# Altium project NetTroll.PrjPcb
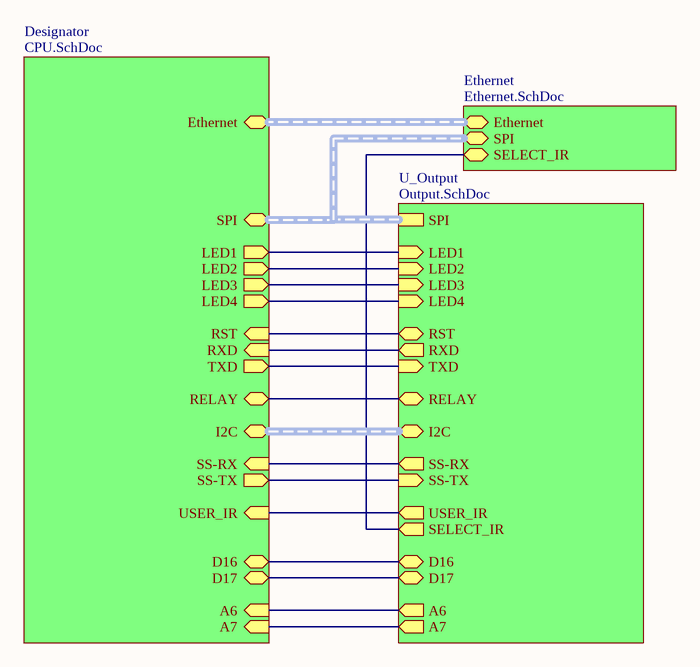
[diagram p0: top.SchDoc]
4 sheets, 90 parts. Net scope: hierarchical (ports join the sheet entries above them; power ports are global).
Board file: NetTroll.PcbDoc
Sheets:
  top.SchDoc
    Designator = CPU.SchDoc
    Ethernet = Ethernet.SchDoc
    U_Output = Output.SchDoc

## Sheet top.SchDoc: WZ1262 - WIZnet Connect the Magic 2014 Design Challenge
size A4; Revision: 1.0

### Sub-sheets
Designator = CPU.SchDoc: A6 (in), A7 (in), D16, Ethernet (harness Ethernet), I2C (harness I2C), LED1 (out), LED2 (out), LED3 (out), LED4 (out), RELAY, RST (in), RXD (in), SPI (harness SPI), SS-RX (in), SS-TX (out), TXD (out), USER_IR (in), D17
Ethernet = Ethernet.SchDoc: SPI (harness SPI), Ethernet (harness Ethernet), SELECT_IR
U_Output = Output.SchDoc: LED1, LED2, LED3, SPI (harness SPI), RST, RXD, TXD, LED4, RELAY, I2C (harness I2C), SS-RX (out), SS-TX (in), USER_IR (out), D16, D17, A6 (out), A7 (out), SELECT_IR (out)

### Nets
A0/D14: sheet Designator/SS-TX, sheet U_Output/SS-TX
A1/D15: sheet Designator/SS-RX, sheet U_Output/SS-RX
A2/D16: sheet Designator/D16, sheet U_Output/D16
A6: sheet Designator/A6, sheet U_Output/A6
A7: sheet Designator/A7, sheet U_Output/A7
D5-PWM: sheet Designator/LED1, sheet U_Output/LED1
D6-PWM: sheet Designator/LED2, sheet U_Output/LED2
D8: sheet Designator/RELAY, sheet U_Output/RELAY
D9-PWM: sheet Designator/LED3, sheet U_Output/LED3
D10-PWM: sheet Designator/LED4, sheet U_Output/LED4
D17: sheet Designator/D17, sheet U_Output/D17
EXT_INT_SEL: sheet Ethernet/SELECT_IR, sheet U_Output/SELECT_IR
INT1/D3: sheet Designator/USER_IR, sheet U_Output/USER_IR
RST: sheet Designator/RST, sheet U_Output/RST
XD1_N: sheet Designator/RXD, sheet U_Output/RXD
XD1_P: sheet Designator/TXD, sheet U_Output/TXD

### Buses and harness runs
harness sheet Designator/Ethernet = sheet Ethernet/Ethernet
harness sheet Designator/I2C = sheet U_Output/I2C
harness sheet Designator/SPI = sheet Ethernet/SPI = sheet U_Output/SPI

## Sheet CPU.SchDoc: WZ1262 - WIZnet Connect the Magic 2014 Design Challenge
size A4; DocumentNumber: 1; Revision: 1.0; SheetNumber: 1; SheetTotal: 4; PageSetup: Record=PageOptions|CenterHorizontal=True|CenterVertical=True|PrintScale=0.31|XCorrection=1.00|YCorrection=1.00|PrintKind=1|BorderSize=5000000|LeftOffset=0|BottomOffset=0|Orientation=2|PaperLength=1000|PaperWidth=1000|Scale=100|PaperSource=7|PrintQuality=600|MediaType=1|DitherType=10|PrintScaleMode=1|PaperKind=A4 (210 x 297mm)|PaperIndex=9
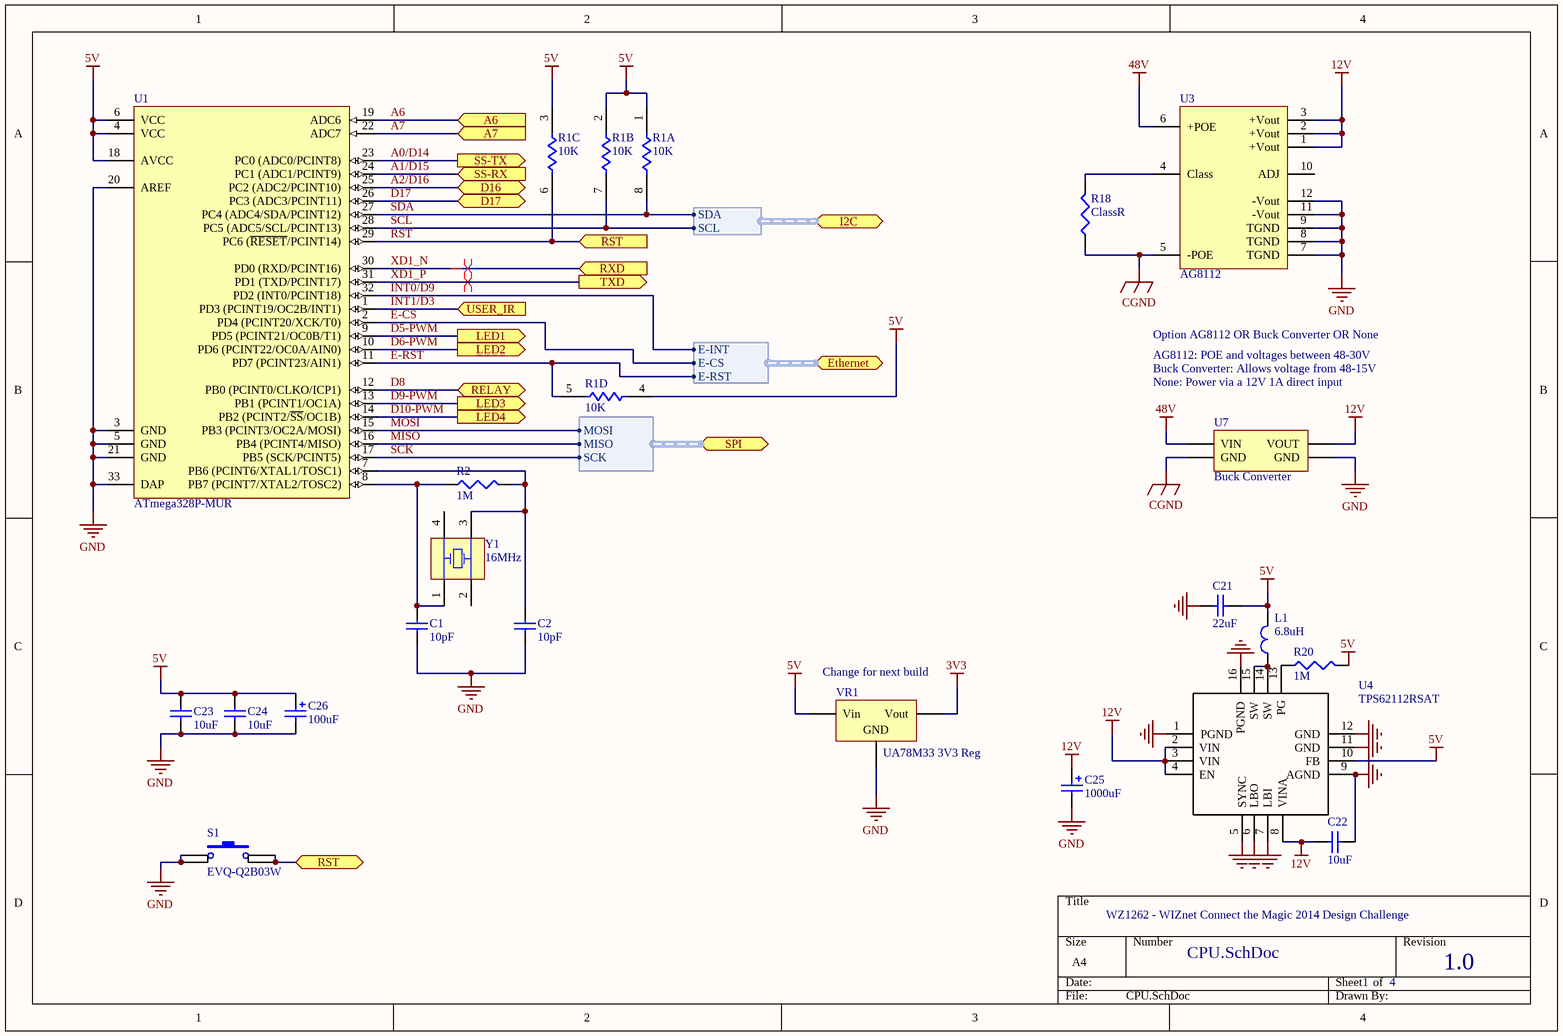
[diagram p1: CPU.SchDoc]

### Parts
C1  10pF  [0603]
C2  10pF  [0603]
C21  22uF  [1210]
C22  10uF  [0603]
C23  10uF  [0603]
C24  10uF  [0603]
C25  1000uF  [PANASONIC_H13]
C26  100uF  [PANASONIC_C]
L1  6.8uH  [1812]
R1  10K  [SO8_S]  (parts A,B,C,D of 4)
R2  1M  [0603]
R18  ClassR  [0603]  (no BOM)
R20  1M  [0603]
S1  EVQ-Q2B03W  [TACTILE_SWITCH_SMD]
U1  ATmega328P-MUR  [32M1-A_N]
U3  AG8112  [AG8100]
U4  TPS62112RSAT  [16-QFN]
U7  Buck Converter  [Buck_Module]
VR1  UA78M33 3V3 Reg  [SOT223]
Y1  16MHz  [CRYSTAL-SMD-2.5X2-ABM10]

### Ports
A6 (in), A7 (in), D16, D17, Ethernet (harness Ethernet), I2C (harness I2C), LED1 (out), LED2 (out), LED3 (out), LED4 (out), RELAY, RST, RST (in), RXD (in), SPI (harness SPI), SS-RX (in), SS-TX (out), TXD (out), USER_IR (in)

### Harnesses
SPI: SCK, MISO, MOSI
Ethernet: E-CS, E-INT, E-RST
I2C: SDA, SCL

### Nets
3V3: VR1.3(Vout)
5V: C21.2 C23.2 C24.2 C26.+ L1.2 R1.1 R1.2 R1.3 R1.4 R20.2 U1.4(VCC) U1.6(VCC) U1.18(AVCC) U4.10(FB) VR1.1(Vin)
12V: C22.1 C25.+ U3.1(+Vout) U3.2(+Vout) U3.3(+Vout) U4.2(VIN) U4.3(VIN) U4.4(EN) U4.8(VINA) U7.2(VOUT)
48V: U3.6(+POE) U7.1(VIN)
CGND: R18.1 U3.5(-POE) U7.4(GND)
GND: C1.1 C2.1 C21.1 C22.2 C23.1 C24.1 C25.- C26.- S1.1 S1.2 U1.3(GND) U1.5(GND) U1.20(AREF) U1.21(GND) U1.33(DAP) U3.7(TGND) U3.8(TGND) U3.9(TGND) U3.11(-Vout) U3.12(-Vout) U4.0(GND) U4.1(PGND) U4.5(SYNC) U4.6(LBO) U4.7(LBI) U4.9(AGND) U4.11(GND) U4.12(GND) U4.16(PGND) U7.3(GND) VR1.2(GND)
A0/D14: U1.23(PC0_(ADC0/PCINT8)) ; port SS-TX
A1/D15: U1.24(PC1_(ADC1/PCINT9)) ; port SS-RX
A2/D16: U1.25(PC2_(ADC2/PCINT10)) ; port D16
A6: U1.19(ADC6) ; port A6
A7: U1.22(ADC7) ; port A7
D5-PWM: U1.9(PD5_(PCINT21/OC0B/T1)) ; port LED1
D6-PWM: U1.10(PD6_(PCINT22/OC0A/AIN0)) ; port LED2
D8: U1.12(PB0_(PCINT0/CLKO/ICP1)) ; port RELAY
D9-PWM: U1.13(PB1_(PCINT1/OC1A)) ; port LED3
D10-PWM: U1.14(PB2_(PCINT2/~{SS}/OC1B)) ; port LED4
D17: U1.26(PC3_(ADC3/PCINT11)) ; port D17
E-CS: U1.2(PD4_(PCINT20/XCK/T0)) ; port Ethernet.E-CS
E-RST: R1.5 U1.11(PD7_(PCINT23/AIN1)) ; port Ethernet.E-RST
INT0/D9: U1.32(PD2_(INT0/PCINT18)) ; port Ethernet.E-INT  [project net E-INT]
INT1/D3: U1.1(PD3_(PCINT19/OC2B/INT1)) ; port USER_IR
MISO: U1.16(PB4_(PCINT4/MISO)) ; port SPI.MISO
MOSI: U1.15(PB3_(PCINT3/OC2A/MOSI)) ; port SPI.MOSI
RST: R1.6 S1.3 S1.4 U1.29(PC6_(~{RESET}/PCINT14)) ; port RST
SCK: U1.17(PB5_(SCK/PCINT5)) ; port SPI.SCK
SCL: R1.7 U1.28(PC5_(ADC5/SCL/PCINT13)) ; port I2C.SCL
SDA: R1.8 U1.27(PC4_(ADC4/SDA/PCINT12)) ; port I2C.SDA
XD1_N: U1.30(PD0_(RXD/PCINT16)) ; port RXD
XD1_P: U1.31(PD1_(TXD/PCINT17)) ; port TXD
NetC1_2: C1.2 R2.1 U1.8(PB7_(PCINT7/XTAL2/TOSC2)) Y1.1(OSC1)
NetC2_2: C2.2 R2.2 U1.7(PB6_(PCINT6/XTAL1/TOSC1)) Y1.3(OSC2)
NetL1_1: L1.1 U4.14(SW) U4.15(SW)
NetR18_2: R18.2 U3.4(Class)
NetR20_1: R20.1 U4.13(PG)

Not connected (* = marked no-connect by the designer): U3 10(ADJ); Y1 2(OSC2) 4(OSC1)

### Layout directives
differential pair: XD1_N, XD1_P

### Notes on the sheet
- Option AG8112 OR Buck Converter OR None
- AG8112: POE and voltages between 48-30V
- Buck Converter: Allows voltage from 48-15V
- None: Power via a 12V 1A direct input
- (near VR1) Change for next build

### Library data of the parts
C1 C2 = Cap_10pF: Capacitor (Semiconductor SIM Model); Published: 8-Jun-2000; LatestRevisionDate: 29-May-2009; LatestRevisionNote: IPC-7351 Footprint Added.; PackageReference: C1206; Publisher: Altium Limited; PackageDescription: Chip Capacitor; Value: 10pF; Supplier 1: Digi-Key; Supplier 2: Mouser; Supplier Part Number 1: 1276-2157-1-ND; Supplier Part Number 2: 80-C0603C100K3G
C21 = Cap_22uF: Capacitor (Semiconductor SIM Model); Published: 8-Jun-2000; LatestRevisionDate: 29-May-2009; LatestRevisionNote: IPC-7351 Footprint Added.; PackageReference: C1206; Publisher: Altium Limited; PackageDescription: Chip Capacitor; Value: 22uF; Supplier 1: Digi-Key; Supplier 2: Mouser; Supplier Part Number 1: 587-1395-1-ND; Supplier Part Number 2: 963-LMK325F226ZN-T
C22-C24 = Cap_10uF: Capacitor (Semiconductor SIM Model); Value: 10uF - 25V; Published: 8-Jun-2000; LatestRevisionDate: 29-May-2009; LatestRevisionNote: IPC-7351 Footprint Added.; PackageReference: C1206; Publisher: Altium Limited; PackageDescription: Chip Capacitor; Supplier 1: Digi-Key; Supplier 2: Mouser; Supplier Part Number 1: 445-9015-1-ND; Supplier Part Number 2: 810-C1608X5R1E106M
C25 = Cap_Polarized_1000uF: Polarized Capacitor (Surface Mount); Published: 8-Jun-2000; LatestRevisionDate: 29-May-2009; LatestRevisionNote: IPC-7351 Footprint Added.; PackageReference: C0805; Publisher: Altium Limited; PackageDescription: Chip Capacitor; Value: 1000uF; Supplier 1: Digi-Key; Supplier 2: Mouser; Supplier Part Number 1: PCE3462CT-ND; Supplier Part Number 2: 140-VE102M1ETR1313
C26 = Cap_Polarized_100uF: Polarized Capacitor (Surface Mount); Published: 8-Jun-2000; LatestRevisionDate: 29-May-2009; LatestRevisionNote: IPC-7351 Footprint Added.; PackageReference: C0805; Publisher: Altium Limited; PackageDescription: Chip Capacitor; Value: 100uF; Supplier 1: Digi-Key; Supplier 2: Mouser; Supplier Part Number 1: PCE4718CT-ND; Supplier Part Number 2: 667-EEE-HAJ101WAR
L1 = INDUCTOR: INDUCTOR WW 6.8UH 1.1A 1812 SMD; MPN: LQH43CN6R8M03L; SPN: 732-4064-6-ND; Cost10: 1.68800; Cost100: 1.28250; Supplier: Digikey; Supplier 1: Digi-Key; Supplier 2: Mouser; Supplier Part Number 1: 490-2518-1-ND; Supplier Part Number 2: 81-LQH43CN6R8M03L
R1 = Resistor_Pack_10K: Isolated Resistor Network - Parts; Sim Note: Enter the Resistance value into parameter field.; Published: 24-Mar-1999; LatestRevisionDate: 29-May-2009; LatestRevisionNote: IPC-7351 Footprint Added.; PackageReference: SOIC16; Publisher: Altium Limited; PackageDescription: 16-Pin Small Outline Integrated Circuit 1.27 mm Pitch; Code_JEDEC: MS-012-AC; Code_IPC: SOIC127P600-16; Value: 10K; Supplier 1: Digi-Key; Supplier 2: Mouser; Supplier Part Number 1: 742C083103JPCT-ND; Supplier Part Number 2: 774-742C083103JP
R2 R20 = Resistor_1M: Resistor; Published: 8-Jun-2000; LatestRevisionDate: 29-May-2009; LatestRevisionNote: IPC-7351 Footprint Added.; PackageReference: J1-0603; Publisher: Altium Limited; PackageDescription: Chip Resistor; Value: 1M; Supplier 1: Digi-Key; Supplier 2: Mouser; Supplier Part Number 1: 311-1MLMCT-ND; Supplier Part Number 2: 603-AF0603FR-071ML
R18 = Resistor: Value: ??; Published: 8-Jun-2000; LatestRevisionDate: 29-May-2009; LatestRevisionNote: IPC-7351 Footprint Added.; PackageReference: J1-0603; Publisher: Altium Limited; PackageDescription: Chip Resistor; Supplier 1: Digi-Key; Supplier 2: Mouser
S1 = SW-PB: Switch; Published: 24-Mar-1999; LatestRevisionDate: 17-Jul-2002; LatestRevisionNote: Re-released for DXP Platform.; PackageReference: SPST-2; Publisher: Altium Limited; PackageDescription: Switch; 2 Leads; Supplier 1: Digi-Key; Supplier 2: Mouser; Supplier Part Number 1: P12932SCT-ND; Supplier Part Number 2: 667-EVQ-Q2B03W
U1 = ATmega328P-MUR: 8-bit AVR Microcontroller, 32KB Flash, 1KB EEPROM, 2KB SRAM, 32-pin MLF, Industrial Grade (-40°C to 85°C); Published: 1-Apr-2010; DatasheetVersion: revA, Jan-2010; PackageVersion: revE, May-2006; PackageReference: 32M1-A; Publisher: Altium Limited; PackageDescription: 32-Pin Micro Lead Frame Package (MLF),  5 x 5 x 1.0 mm Body, Pitch 0.50 mm, 3.10mm Exposed Pad; Supplier 1: Digi-Key; Supplier Part Number 1: ATMEGA328P-MURCT-ND; Supplier 2: Mouser; Supplier Part Number 2: 556-ATMEGA328P-MU; Code_JEDEC: MO-220-VHHD-2; ComponentLink1Description: Manufacturer Link; ComponentLink1URL: http://www.atmel.com/products/avr/default.asp?; ComponentLink2Description: ATmega48A/48PA/88A/88PA/168A/168PA/328/328P Datasheet; ComponentLink2URL: http://www.atmel.com/dyn/resources/prod_documents/8271.pdf; ComponentLink3Description: ATmega48A/48PA/88A/88PA/168A/168PA/328/328P Summary; ComponentLink3URL: http://www.atmel.com/dyn/resources/prod_documents/8271S.pdf; ComponentLink4Description: Atmel.com Home; ComponentLink4URL: http://www.atmel.com
U3 = AG8100: POE Controller and Buck Converter
U4 = TPS62112RSAT: IC REG BUCK SYNC 5V 1.5A 16QFN; SPN: 296-19717-6-ND; Cost10: 3.83100; Cost100: 2.00480; MPN: TPS62112RSAT; Supplier: Digikey; Supplier 1: Digi-Key; Supplier 2: Mouser; Supplier Part Number 1: 296-19717-1-ND; Supplier Part Number 2: 595-TPS62112RSAT
U7 = Buck: Adjustable Buck Converter Module; LatestRevisionDate: 17-Jul-2002; LatestRevisionNote: Re-released for DXP Platform.; Publisher: Altium Limited
VR1 = Volt Reg: Voltage Regulator; Published: 24-Mar-1999; LatestRevisionDate: 29-May-2009; LatestRevisionNote: IPC-7351 Footprint Added.; PackageReference: D2PAK; Publisher: Altium Limited; PackageDescription: 3-Pin Transistor Outline Package 2.54 mm Pitch, 15.1 mm Lead Span; Part: UA78M33; Supplier 1: Digi-Key; Supplier 2: Mouser; Supplier Part Number 1: 296-27140-5-ND; Supplier Part Number 2: 595-UA78M33CDCY
Y1 = Crystal_16MHz: Surface Mount Quartz Crystal; Note: PCB layout complies with manufacturer's recommendation.; Published: 17-Jul-2002; DatasheetDocument: 28-Aug-2001; PackageDocument: 28-Aug-2001; PackageReference: 91SMX; Publisher: Altium Limited; ComponentLink1Description: Manufacturer Link; ComponentLink1URL: http://www.cmac.com/mt/; ComponentLink2Description: Datasheet; ComponentLink2URL: http://www.cmac.com/mt/databook/crystals/smd/90_91_smx.pdf; Value: 16MHz; Supplier 1: Digi-Key; Supplier 2: Mouser; Supplier Part Number 1: 1253-1122-1-ND; Supplier Part Number 2: 732-FA20H-16F12Z-AC3

## Sheet Ethernet.SchDoc: WZ1262 - WIZnet Connect the Magic 2014 Design Challenge
size A4; DocumentNumber: 2; Revision: 1.0; SheetNumber: 2; SheetTotal: 4
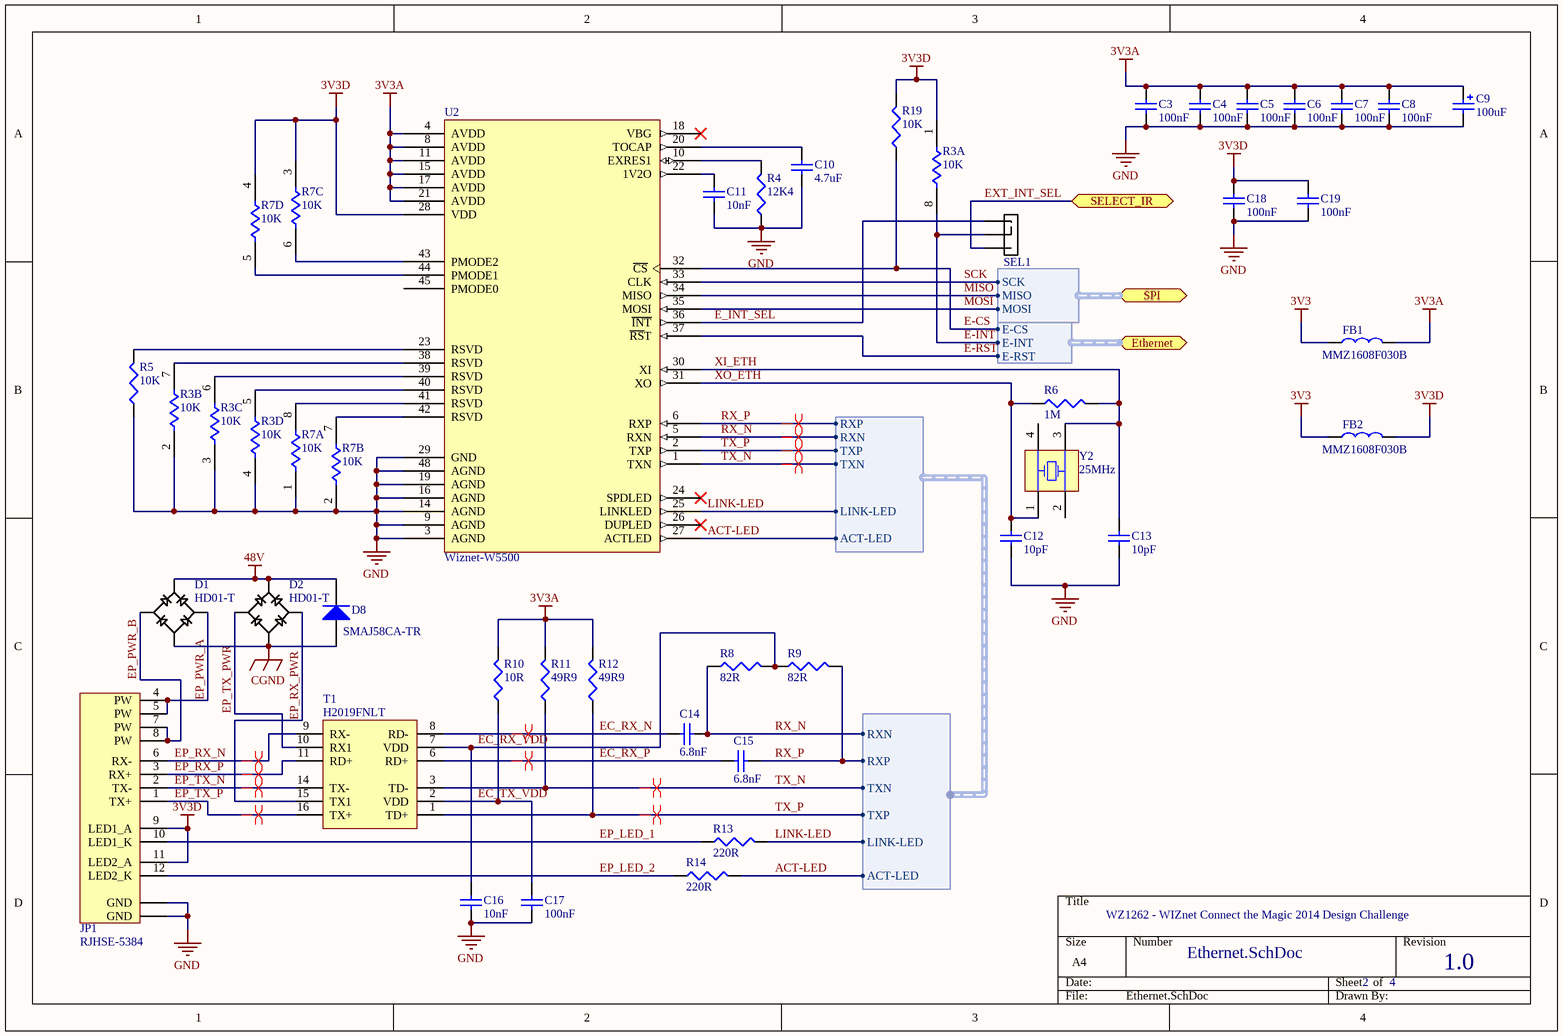
[diagram p2: Ethernet.SchDoc]

### Parts
C3  100nF  [0603]
C4  100nF  [0603]
C5  100nF  [0603]
C6  100nF  [0603]
C7  100nF  [0603]
C8  100nF  [0603]
C9  100uF  [PANASONIC_C]
C10  4.7uF  [0603]
C11  10nF  [0603]
C12  10pF  [0603]
C13  10pF  [0603]
C14  6.8nF  [0603]
C15  6.8nF  [0603]
C16  10nF  [0603]
C17  100nF  [0603]
C18  100nF  [0603]
C19  100nF  [0603]
D1  HD01-T  [MBS]
D2  HD01-T  [MBS]
D8  SMAJ58CA-TR  [SMBJ]
FB1  MMZ1608F030B  [0603]
FB2  MMZ1608F030B  [0603]
JP1  RJHSE-5384  [RJHSE-5484]
R3  10K  [SO8_S]  (parts A,B,C,D of 4)
R4  12K4  [0603]
R5  10K  [0603]
R6  1M  [0603]
R7  10K  [SO8_S]  (parts A,B,C,D of 4)
R8  82R  [0603]
R9  82R  [0603]
R10  10R  [0603]
R11  49R9  [0603]
R12  49R9  [0603]
R13  220R  [0603]
R14  220R  [0603]
R19  10K  [0603]
SEL1  SELECTOR  [SJ_3_PASTE2&3]  (value not drawn)  (no BOM)
T1  H2019FNLT  [HXXXX]
U2  Wiznet-W5500  [QFN48]
Y2  25MHz  [CRYSTAL-SMD-2.5X2-ABM10]

### Ports
Ethernet (harness Ethernet), SELECT_IR, SPI (harness SPI)

### Harnesses
SPI: SCK, MISO, MOSI
Ethernet: E-CS, E-INT, E-RST
RJ45: RXP, RXN, TXP, TXN, LINK-LED, ACT-LED

### Nets
3V3: FB1.1 FB2.1
3V3A: C3.2 C4.2 C5.2 C6.2 C7.2 C8.2 C9.+ FB1.2 R10.2 R11.2 R12.2 U2.4(AVDD) U2.8(AVDD) U2.11(AVDD) U2.15(AVDD) U2.17(AVDD) U2.21(AVDD)
3V3D: C18.2 C19.2 FB2.2 JP1.9(LED1_A) JP1.11(LED2_A) R3.1 R7.3 R7.4 R19.2 U2.28(VDD)
48V: D1.+ D2.+ D8.2(K)
CGND: D1.- D2.- D8.1(A)
GND: C3.1 C4.1 C5.1 C6.1 C7.1 C8.1 C9.- C10.1 C11.1 C12.1 C13.1 C16.1 C17.1 C18.1 C19.1 JP1.GND1(GND) JP1.GND2(GND) R3.2 R3.3 R3.4 R4.1 R5.1 R7.1 R7.2 U2.3(AGND) U2.9(AGND) U2.14(AGND) U2.16(AGND) U2.19(AGND) U2.29(GND) U2.48(AGND)
ACT-LED: R14.2 U2.27(ACTLED) ; harness RJ45.ACT-LED
E-CS: R19.1 U2.32(~{CS}) ; port Ethernet.E-CS
E-INT: R3.8 SEL1.2 ; port Ethernet.E-INT
E-RST: U2.37(~{RS}T) ; port Ethernet.E-RST
E_INT_SEL: SEL1.3 U2.36(~{INT})
EC_RX_N: C14.1 T1.8(RD-)
EC_RX_P: C15.1 T1.6(RD+)
EC_RX_VDD: C16.2 R8.2 R9.1 T1.7(VDD)
EC_TX_VDD: C17.2 R10.1 T1.2(VDD)
EP_LED_1: JP1.10(LED1_K) R13.1
EP_LED_2: JP1.12(LED2_K) R14.1
EP_PWR_A: D1.AC2 JP1.4(PW) JP1.5(PW)
EP_PWR_B: D1.AC1 JP1.7(PW) JP1.8(PW)
EP_RX_N: JP1.6(RX-) T1.9(RX-)
EP_RX_P: JP1.3(RX+) T1.11(RD+)
EP_RX_PWR: D2.AC2 T1.15(TX1)
EP_TX_N: JP1.2(TX-) T1.14(TX-)
EP_TX_P: JP1.1(TX+) T1.16(TX+)
EP_TX_PWR: D2.AC1 T1.10(RX1)
EXT_INT_SEL: SEL1.1 ; port SELECT_IR
LINK-LED: R13.2 U2.25(LINKLED) ; harness RJ45.LINK-LED
MISO: U2.34(MISO) ; port SPI.MISO
MOSI: U2.35(MOSI) ; port SPI.MOSI
RX_N: C14.2 R8.1 U2.5(RXN) ; harness RJ45.RXN
RX_P: C15.2 R9.2 U2.6(RXP) ; harness RJ45.RXP
SCK: U2.33(CLK) ; port SPI.SCK
TX_N: R11.1 T1.3(TD-) U2.1(TXN) ; harness RJ45.TXN
TX_P: R12.1 T1.1(TD+) U2.2(TXP) ; harness RJ45.TXP
XI_ETH: C13.2 R6.2 U2.30(XI) Y2.3(OSC2)
XO_ETH: C12.2 R6.1 U2.31(XO) Y2.1(OSC1)
NetC10_2: C10.2 U2.20(TOCAP)
NetC11_2: C11.2 U2.22(1V2O)
NetR3_5: R3.5 U2.40(RSVD)
NetR3_6: R3.6 U2.39(RSVD)
NetR3_7: R3.7 U2.38(RSVD)
NetR4_2: R4.2 U2.10(EXRES1)
NetR5_2: R5.2 U2.23(RSVD)
NetR7_5: R7.5 U2.44(PMODE1)
NetR7_6: R7.6 U2.43(PMODE2)
NetR7_7: R7.7 U2.42(RSVD)
NetR7_8: R7.8 U2.41(RSVD)

Not connected (* = marked no-connect by the designer): U2 18(VBG)* 24(SPDLED)* 26(DUPLED)* 45(PMODE0); Y2 2(OSC2) 4(OSC1)

### Layout directives
differential pair: EC_RX_N, EC_RX_P, EP_RX_N, EP_RX_P, EP_TX_N, EP_TX_P, RX_N, RX_P, TX_N, TX_P

### Library data of the parts
C3-C8 C18 C19 = Cap_100pF: Capacitor (Semiconductor SIM Model); Value: 100pF; Published: 8-Jun-2000; LatestRevisionDate: 29-May-2009; LatestRevisionNote: IPC-7351 Footprint Added.; PackageReference: C1206; Publisher: Altium Limited; PackageDescription: Chip Capacitor; Supplier 1: Digi-Key; Supplier Part Number 1: 399-1096-1-ND; Supplier 2: Mouser; Supplier Part Number 2: 80-C0603C104K3R
C9 = Cap_Polarized_100uF: Polarized Capacitor (Surface Mount); Published: 8-Jun-2000; LatestRevisionDate: 29-May-2009; LatestRevisionNote: IPC-7351 Footprint Added.; PackageReference: C0805; Publisher: Altium Limited; PackageDescription: Chip Capacitor; Value: 100uF; Supplier 1: Digi-Key; Supplier 2: Mouser; Supplier Part Number 1: PCE4718CT-ND; Supplier Part Number 2: 667-EEE-HAJ101WAR
C10 = Cap_4.7uF: Capacitor (Semiconductor SIM Model); Published: 8-Jun-2000; LatestRevisionDate: 29-May-2009; LatestRevisionNote: IPC-7351 Footprint Added.; PackageReference: C1206; Publisher: Altium Limited; PackageDescription: Chip Capacitor; Value: 4.7uF; Supplier 1: Digi-Key; Supplier 2: Mouser; Supplier Part Number 1: 1276-2087-1-ND; Supplier Part Number 2: 80-C0603C475M8P
C11 C16 = Cap_10nF: Capacitor (Semiconductor SIM Model); Published: 8-Jun-2000; LatestRevisionDate: 29-May-2009; LatestRevisionNote: IPC-7351 Footprint Added.; PackageReference: C1206; Publisher: Altium Limited; PackageDescription: Chip Capacitor; Value: 10nF; Supplier 1: Digi-Key; Supplier 2: Mouser; Supplier Part Number 1: 1276-1927-1-ND; Supplier Part Number 2: 77-VJ0603Y103KXAAC; Supplier 3: Digi-Key; Supplier Part Number 3: 399-1091-1-ND
C12 C13 = Cap_10pF: Capacitor (Semiconductor SIM Model); Published: 8-Jun-2000; LatestRevisionDate: 29-May-2009; LatestRevisionNote: IPC-7351 Footprint Added.; PackageReference: C1206; Publisher: Altium Limited; PackageDescription: Chip Capacitor; Value: 10pF; Supplier 1: Digi-Key; Supplier 2: Mouser; Supplier Part Number 1: 1276-2157-1-ND; Supplier Part Number 2: 80-C0603C100K3G
C14 C15 = Cap_6.8nF: Capacitor (Semiconductor SIM Model); Published: 8-Jun-2000; LatestRevisionDate: 29-May-2009; LatestRevisionNote: IPC-7351 Footprint Added.; PackageReference: C1206; Publisher: Altium Limited; PackageDescription: Chip Capacitor; Value: 6.8nF; Supplier 1: Digi-Key; Supplier 2: Mouser; Supplier Part Number 1: 1276-2103-1-ND; Supplier Part Number 2: 77-VJ0603Y682MXQPBC
C17 = Cap_100nF: Capacitor (Semiconductor SIM Model); Published: 8-Jun-2000; LatestRevisionDate: 29-May-2009; LatestRevisionNote: IPC-7351 Footprint Added.; PackageReference: C1206; Publisher: Altium Limited; PackageDescription: Chip Capacitor; Value: 100nF; Supplier 1: Digi-Key; Supplier 2: Mouser; Supplier Part Number 1: 399-1096-1-ND; Supplier Part Number 2: 80-C0603C104K3R
D1 D2 = Diode Bridge: Published: 8-Jun-2000; LatestRevisionDate: 29-May-2009; LatestRevisionNote: IPC-7351 Footprint Added.; PackageReference: J1-0603; Publisher: Altium Limited; PackageDescription: Chip Resistor; Value: -; Supplier 1: Digi-Key; Supplier 2: Mouser; Supplier Part Number 1: HD01DICT-ND; Supplier Part Number 2: 621-HD01-T
D8 = Diode_POWER: Default Diode; Published: 8-Jun-2000; LatestRevisionDate: 17-Jul-2002; LatestRevisionNote: Re-released for DXP Platform.; PackageVersion: Sep-1996; PackageReference: SMC; Publisher: Altium Limited; PackageDescription: DO-214-AB/SMC; 2 C-Bend Leads; Body 7.9 x 5.9 mm, inc. leads (LxW); Code_JEDEC: DO-214-AB; Supplier 1: Digi-Key; Supplier 2: Mouser; Supplier Part Number 1: 497-6509-1-ND; Supplier Part Number 2: 511-SMAJ58CA-TR
FB1 FB2 = Ferrite Bead: Value: HH-1M1608-121JT; Published: 8-Jun-2000; LatestRevisionDate: 29-May-2009; LatestRevisionNote: IPC-7351 Footprint Added.; PackageReference: J1-0603; Publisher: Altium Limited; PackageDescription: Chip Resistor; Supplier 1: Digi-Key; Supplier 2: Mouser; Supplier Part Number 1: 445-8676-1-ND; Supplier Part Number 2: 810-MMZ1608F030B
JP1 = Ethernet Socket: Ethernet Socket RJ45 With Leds; Supplier 1: Digi-Key; Supplier 2: Mouser; Supplier Part Number 1: RJHSE-5384-ND; Supplier Part Number 2: 523-RJHSE-5484
R3 R7 = Resistor_Pack_10K: as R1 on sheet CPU; Published: 24-Mar-1999; LatestRevisionDate: 29-May-2009; LatestRevisionNote: IPC-7351 Footprint Added.; PackageReference: SOIC16; Publisher: Altium Limited; PackageDescription: 16-Pin Small Outline Integrated Circuit 1.27 mm Pitch; Code_JEDEC: MS-012-AC; Code_IPC: SOIC127P600-16; Value: 10K; Supplier 1: Digi-Key; Supplier 2: Mouser; Supplier Part Number 1: 742C083103JPCT-ND; Supplier Part Number 2: 774-742C083103JP
R4 = Resistor_12K4: Resistor; Published: 8-Jun-2000; LatestRevisionDate: 29-May-2009; LatestRevisionNote: IPC-7351 Footprint Added.; PackageReference: J1-0603; Publisher: Altium Limited; PackageDescription: Chip Resistor; Value: 12K4; Supplier 1: Digi-Key; Supplier 2: Mouser; Supplier Part Number 1: 1276-4752-1-ND; Supplier Part Number 2: 71-CRCW0603-12.4K-E3
R5 R19 = Resistor_10K: Resistor; Published: 8-Jun-2000; LatestRevisionDate: 29-May-2009; LatestRevisionNote: IPC-7351 Footprint Added.; PackageReference: J1-0603; Publisher: Altium Limited; PackageDescription: Chip Resistor; Value: 10K; Supplier 1: Digi-Key; Supplier 2: Mouser; Supplier Part Number 1: 311-10KGRCT-ND; Supplier Part Number 2: 603-AF0603FR-0710KL
R6 = Resistor_1M: Resistor; Published: 8-Jun-2000; LatestRevisionDate: 29-May-2009; LatestRevisionNote: IPC-7351 Footprint Added.; PackageReference: J1-0603; Publisher: Altium Limited; PackageDescription: Chip Resistor; Value: 1M; Supplier 1: Digi-Key; Supplier 2: Mouser; Supplier Part Number 1: 311-1MLMCT-ND; Supplier Part Number 2: 603-AF0603FR-071ML
R8 R9 = Resistor_82R: Resistor; Published: 8-Jun-2000; LatestRevisionDate: 29-May-2009; LatestRevisionNote: IPC-7351 Footprint Added.; PackageReference: J1-0603; Publisher: Altium Limited; PackageDescription: Chip Resistor; Value: 82R; Supplier 1: Digi-Key; Supplier 2: Mouser; Supplier Part Number 1: 311-82GRCT-ND; Supplier Part Number 2: 660-RK73H1JTTD82R0F
R10 = Resistor_10R: Resistor; Published: 8-Jun-2000; LatestRevisionDate: 29-May-2009; LatestRevisionNote: IPC-7351 Footprint Added.; PackageReference: J1-0603; Publisher: Altium Limited; PackageDescription: Chip Resistor; Value: 10R; Supplier 1: Digi-Key; Supplier 2: Mouser; Supplier Part Number 1: 1276-5014-1-ND; Supplier Part Number 2: 71-CRCW0603-10-E3
R11 R12 = Resistor_49R9: Resistor; Published: 8-Jun-2000; LatestRevisionDate: 29-May-2009; LatestRevisionNote: IPC-7351 Footprint Added.; PackageReference: J1-0603; Publisher: Altium Limited; PackageDescription: Chip Resistor; Value: 49R9; Supplier 1: Digi-Key; Supplier 2: Mouser; Supplier Part Number 1: RHM49.9CFCT-ND; Supplier Part Number 2: 660-RK73H1JTTD49R9F
R13 R14 = Resistor_220R: Resistor; Published: 8-Jun-2000; LatestRevisionDate: 29-May-2009; LatestRevisionNote: IPC-7351 Footprint Added.; PackageReference: J1-0603; Publisher: Altium Limited; PackageDescription: Chip Resistor; Value: 220R; Supplier 1: Digi-Key; Supplier 2: Mouser; Supplier Part Number 1: 311-220GRCT-ND; Supplier Part Number 2: 660-RK73H1JTTD2200F
SEL1 = SELECTOR: Solder Selector
T1 = Magnetics: Power over Ethernet Magnetic Module; Published: 24-Mar-1999; LatestRevisionDate: 17-Jul-2002; LatestRevisionNote: Re-released for DXP Platform.; PackageReference: MODULE5B; Publisher: Altium Limited; Supplier 1: Digi-Key; Supplier 2: Mouser; Supplier Part Number 2: 673-H2019FNLT
U2 = Wiznet-W5500: W5500 Fast SPI Ethernet Controller; Supplier 1: Digi-Key; Supplier Part Number 1: 1278-1021-ND; Supplier 2: Mouser; Supplier Part Number 2: 950-W5500; Code_JEDEC: MO-220-VHHD-2; ComponentLink1Description: Manufacturer Link; ComponentLink1URL: http://www.wiznet.co.kr/Sub_Modules/en/product/Product_Detail.asp?cate1=5&cate2=7&cate3=77&pid=1193
Y2 = Crystal_25MHz: Surface Mount Quartz Crystal; Note: PCB layout complies with manufacturer's recommendation.; Published: 17-Jul-2002; DatasheetDocument: 28-Aug-2001; PackageDocument: 28-Aug-2001; PackageReference: 91SMX; Publisher: Altium Limited; ComponentLink1Description: Manufacturer Link; ComponentLink1URL: http://www.cmac.com/mt/; ComponentLink2Description: Datasheet; ComponentLink2URL: http://www.cmac.com/mt/databook/crystals/smd/90_91_smx.pdf; Value: 25MHz; Supplier 1: Digi-Key; Supplier 2: Mouser; Supplier Part Number 1: 535-9095-1-ND; Supplier Part Number 2: 815-ABM10-25-E20-T

## Sheet Output.SchDoc: WZ1262 - WIZnet Connect the Magic 2014 Design Challenge
size A4; DocumentNumber: 3; Revision: 1.0; SheetNumber: 3; SheetTotal: 4
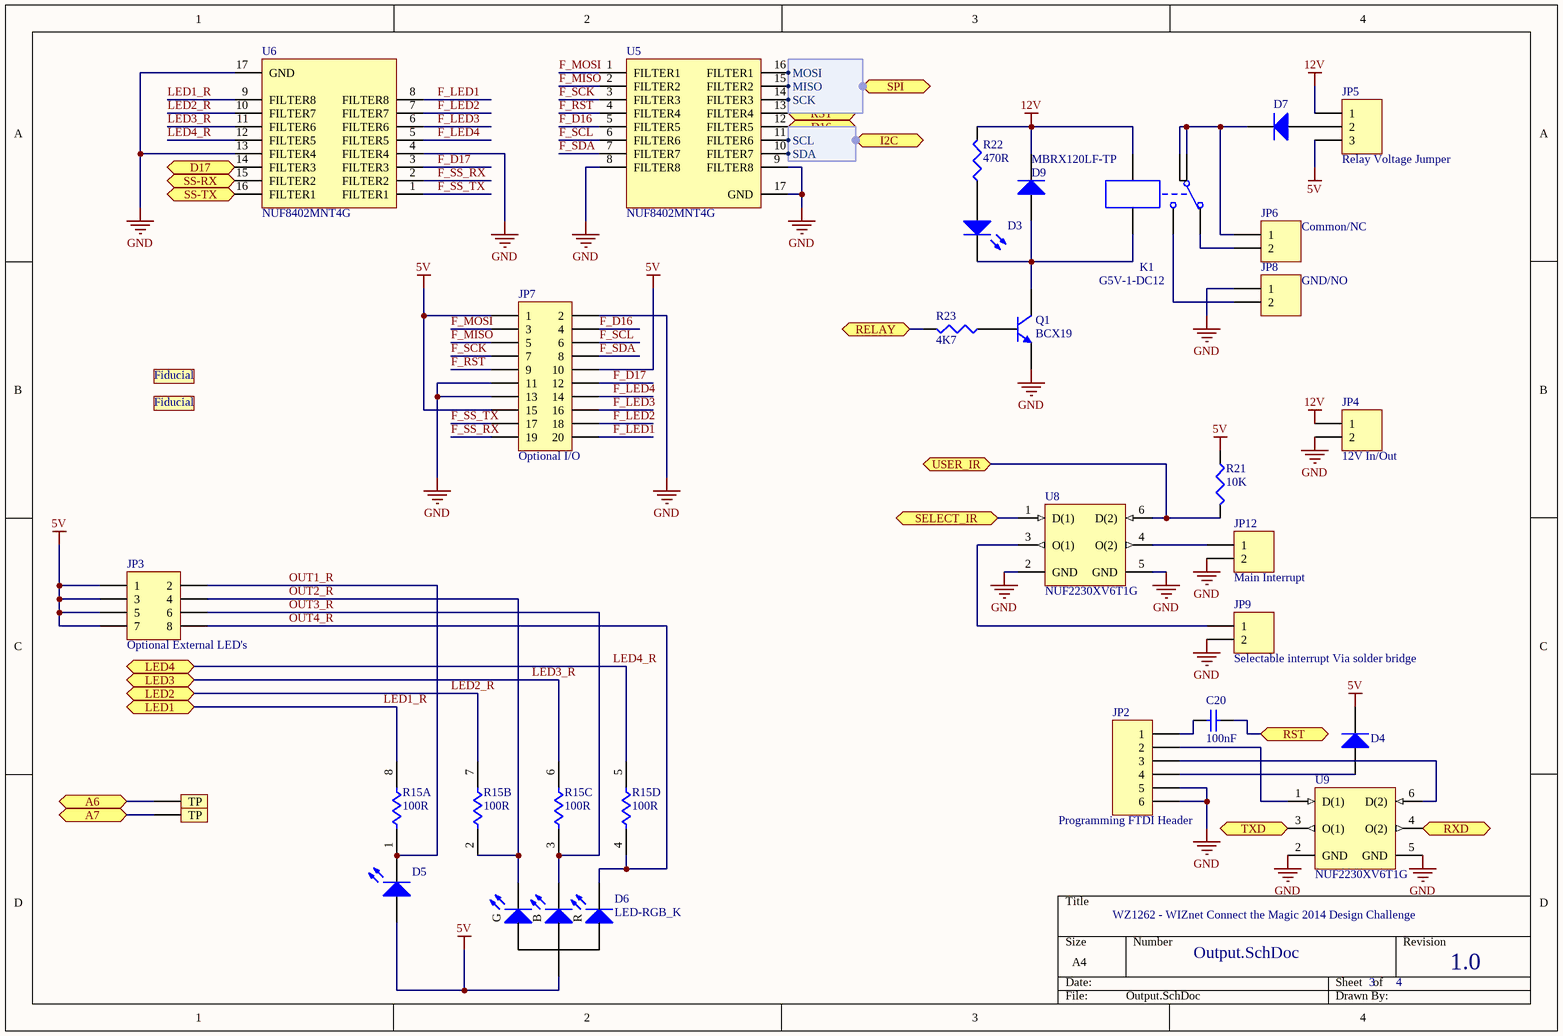
[diagram p3: Output.SchDoc]

### Parts
C20  100nF  [0603]
D3  LED  [LED-0603]  (value not drawn)
D4  Diode  [SOD-123]  (value not drawn)
D5  LED  [LED-0603]  (value not drawn)
D6  LED-RGB_K  [RGB-CLVBAFKA]
D7  Diode  [SOD-123]  (value not drawn)
D9  manufacturer: MBRX120LF-TP  [SOD-123]  (hidden comment: Diode)
FD1  Fiducial  [FD]  (value not drawn)  (no BOM)
FD2  Fiducial  [FD]  (value not drawn)  (no BOM)
JP2  Programming FTDI Header  [1X6]
JP3  Optional External LED's  [2X4]
JP4  12V In/Out  [SCREWTERMINAL-3.5MM-2]
JP5  Relay Voltage Jumper  [1X3]
JP6  Common/NC  [SCREWTERMINAL-3.5MM-2]
JP7  Optional I/O  [2X10]
JP8  GND/NO  [SCREWTERMINAL-3.5MM-2]
JP9  Selectable interrupt Via solder bridge  [SCREWTERMINAL-3.5MM-2]
JP12  Main Interrupt  [SCREWTERMINAL-3.5MM-2]
K1  G5V-1-DC12  [G5V-1]
Q1  BCX19  [SOT23-3]
R15  100R  [SO8_S]  (parts A,B,C,D of 4)
R21  10K  [0603]
R22  470R  [0603]
R23  4K7  [0603]
TP1  Test Point  [PAD.03X.05]  (value not drawn)  (no BOM)
TP2  Test Point  [PAD.03X.05]  (value not drawn)  (no BOM)
U5  NUF8402MNT4G  [ONSC-DFN-16-506AC_V]
U6  NUF8402MNT4G  [ONSC-DFN-16-506AC_V]
U8  NUF2230XV6T1G  [ONSC-SOT-563-6-463A-01_V]
U9  NUF2230XV6T1G  [ONSC-SOT-563-6-463A-01_V]

### Ports
A6, A7, D16, D17, I2C (harness I2C), LED1, LED2, LED3, LED4, RELAY, RST, RXD, SELECT_IR, SPI (harness SPI), SS-RX, SS-TX, TXD, USER_IR

### Harnesses
SPI: SCK, MISO, MOSI
I2C: SDA, SCL

### Nets
5V: D4.2(K) D5.1(A) D6.2(A) JP3.1 JP3.3 JP3.5 JP3.7 JP5.3 JP7.1 JP7.10 JP7.15 R21.1
12V: D9.2(K) JP4.1 JP5.1 K1.2 R22.2
GND: JP2.5 JP2.6 JP4.2 JP7.2 JP7.11 JP7.13 JP8.1 JP9.2 JP12.2 Q1.1(E) U5.8(FILTER8) U5.9(FILTER8) U5.17(GND) U6.4(FILTER4) U6.13(FILTER4) U6.17(GND) U8.2(GND) U8.5(GND) U9.2(GND) U9.5(GND)
A0/D14: U6.16(FILTER1) ; port SS-TX
A1/D15: U6.15(FILTER2) ; port SS-RX
A2/D16: U5.12(FILTER5) ; port D16
A6: TP1.1(TP) ; port A6
A7: TP2.1(TP) ; port A7
D8: R23.2 ; port RELAY
D17: U6.14(FILTER3) ; port D17
EXT_INT_SEL: U8.1(D(1)) ; port SELECT_IR
F_D16: JP7.4 U5.5(FILTER5)
F_D17: JP7.12 U6.3(FILTER3)
F_LED1: JP7.20 U6.8(FILTER8)
F_LED2: JP7.18 U6.7(FILTER7)
F_LED3: JP7.16 U6.6(FILTER6)
F_LED4: JP7.14 U6.5(FILTER5)
F_MISO: JP7.5 U5.2(FILTER2)
F_MOSI: JP7.3 U5.1(FILTER1)
F_RST: JP7.9 U5.4(FILTER4)
F_SCK: JP7.7 U5.3(FILTER3)
F_SCL: JP7.6 U5.6(FILTER6)
F_SDA: JP7.8 U5.7(FILTER7)
F_SS_RX: JP7.19 U6.2(FILTER2)
F_SS_TX: JP7.17 U6.1(FILTER1)
INT1/D3: R21.2 U8.6(D(2)) ; port USER_IR
LED1_R: R15.8 U6.9(FILTER8) ; port LED1  [project net D5-PWM]
LED2_R: R15.7 U6.10(FILTER7) ; port LED2  [project net D6-PWM]
LED3_R: R15.6 U6.11(FILTER6) ; port LED3  [project net D9-PWM]
LED4_R: R15.5 U6.12(FILTER5) ; port LED4  [project net D10-PWM]
MISO: U5.15(FILTER2) ; port SPI.MISO
MOSI: U5.16(FILTER1) ; port SPI.MOSI
OUT1_R: D5.2(K) JP3.2 R15.1
OUT2_R: D6.4(K-G) JP3.4 R15.2
OUT3_R: D6.3(K-B) JP3.6 R15.3
OUT4_R: D6.1(K-R) JP3.8 R15.4
RST: C20.2 U5.13(FILTER4) ; port RST
SCK: U5.14(FILTER3) ; port SPI.SCK
SCL: U5.11(FILTER6) ; port I2C.SCL
SDA: U5.10(FILTER7) ; port I2C.SDA
XD1_N: U9.4(O(2)) ; port RXD
XD1_P: U9.3(O(1)) ; port TXD
NetC20_1: C20.1 JP2.1
NetD3_1: D3.1(A) R22.1
NetD3_2: D3.2(K) D9.1(A) K1.9 Q1.3(C)
NetD4_1: D4.1(A) JP2.4
NetD7_1: D7.1(A) JP5.2
NetD7_2: D7.2(K) JP6.1 K1.5 K1.6
NetJP2_2: JP2.2 U9.1(D(1))
NetJP2_3: JP2.3 U9.6(D(2))
NetJP6_2: JP6.2 K1.1
NetJP8_2: JP8.2 K1.10
NetJP9_1: JP9.1 U8.3(O(1))
NetJP12_1: JP12.1 U8.4(O(2))
NetQ1_2: Q1.2(B) R23.1

### Notes on the sheet
- (in symbol LED-RGB_K) G; B; R

### Library data of the parts
C20 = Cap_100nF: Capacitor (Semiconductor SIM Model); Published: 8-Jun-2000; LatestRevisionDate: 29-May-2009; LatestRevisionNote: IPC-7351 Footprint Added.; PackageReference: C1206; Publisher: Altium Limited; PackageDescription: Chip Capacitor; Value: 100nF; Supplier 1: Digi-Key; Supplier 2: Mouser; Supplier Part Number 1: 399-1096-1-ND; Supplier Part Number 2: 80-C0603C104K3R
D3 D5 = LED: Typical RED, GREEN, YELLOW, AMBER GaAs LED; Published: 8-Jun-2000; LatestRevisionDate: 17-Jul-2002; LatestRevisionNote: Re-released for DXP Platform.; PackageVersion: Feb-2002; PackageReference: 3.2X1.6X1.1; Publisher: Altium Limited; PackageDescription: SM LED; 2 Flat Leads; Supplier 1: Digi-Key; Supplier 2: Mouser; Supplier Part Number 1: 475-1409-1-ND; Supplier Part Number 2: 720-LGQ971-KN-1
D4 D7 D9 = Diode: Default Diode; pin to pad: 1>A 2>K; Published: 8-Jun-2000; LatestRevisionDate: 17-Jul-2002; LatestRevisionNote: Re-released for DXP Platform.; PackageVersion: Sep-1996; PackageReference: SMC; Publisher: Altium Limited; PackageDescription: DO-214-AB/SMC; 2 C-Bend Leads; Body 7.9 x 5.9 mm, inc. leads (LxW); Code_JEDEC: DO-214-AB; Supplier 1: Digi-Key; Supplier 2: Mouser; Supplier Part Number 1: MBRX120LF-TPMSCT-ND; Supplier Part Number 2: 833-MBRX120LF-TP; Supplier 3: Farnell; Supplier Part Number 3: 1924371
D6 = LED-RGB_K: RED, GREEN, BLUE LED; Published: 8-Jun-2000; LatestRevisionDate: 17-Jul-2002; LatestRevisionNote: Re-released for DXP Platform.; PackageVersion: Feb-2002; PackageReference: 3.2X1.6X1.1; Publisher: Altium Limited; PackageDescription: SM LED; 2 Flat Leads; Supplier 1: Digi-Key; Supplier 2: Mouser; Supplier Part Number 1: CLVBA-FKA-CAEDH8BBB7A363CT-ND; Supplier Part Number 2: 941-VBAFKACAEDH8B7A3; Supplier Part Number 3: 941-CLV1LFKBC7673673; Supplier 3: Mouser
JP2 = Header 6: Header, 6-Pin; Supplier 1: Digi-Key; Supplier 2: Mouser; Supplier Part Number 1: 952-2270-ND; Supplier Part Number 2: 538-90120-1086
JP3 = Header 4x2: Header, 8-Pin; Supplier 1: Digi-Key; Supplier 2: Mouser; Supplier Part Number 1: 952-1788-ND; Supplier Part Number 2: 855-M20-9980446
JP4 JP6 JP8 JP9 JP12 = Header 2_ST: Header, 2-Pin; LatestRevisionDate: 17-Jul-2002; LatestRevisionNote: Re-released for DXP Platform.; Publisher: Altium Limited; Supplier 1: Digi-Key; Supplier 2: Mouser; Supplier Part Number 1: A98036-ND; Supplier Part Number 2: 571-1776275-2
JP5 = Header 3: Header, 3-Pin; LatestRevisionDate: 17-Jul-2002; LatestRevisionNote: Re-released for DXP Platform.; Publisher: Altium Limited; Supplier 1: Digi-Key; Supplier 2: Mouser; Supplier Part Number 1: 952-2264-ND; Supplier Part Number 2: 538-42375-1856
JP7 = Header 10X2: Header, 10-Pin, Dual row; LatestRevisionDate: 17-Jul-2002; LatestRevisionNote: Re-released for DXP Platform.; Publisher: Altium Limited; Supplier 1: Digi-Key; Supplier Part Number 1: ED10524-ND
K1 = Relay-SPDT: Single-Pole Dual-Throw Relay; Published: 24-Mar-1999; LatestRevisionDate: 17-Jul-2002; LatestRevisionNote: Re-released for DXP Platform.; PackageReference: MODULE5B; Publisher: Altium Limited; Supplier 1: Digi-Key; Supplier 2: Mouser; Supplier Part Number 1: Z774-ND; Supplier Part Number 2: 653-G5V-1-DC12
Q1 = BCX19: NPN General Purpose; Published: 8-Jun-2000; LatestRevisionDate: 15-Jan-2003; LatestRevisionNote: PCB Footprint 'BCY-W3/D4.7' replaced; DatasheetVersion: 1997; PackageVersion: Sep-1998; PackageReference: TO-92A; Publisher: Altium Limited; PackageDescription: TO, Flat Index; 3 In-Line, Axial Leads; Body Dia. 4.5mm; Leads 0.51 x 0.48 mm (max); ComponentLink1Description: Manufacturer Link; ComponentLink1URL: http://www.fairchildsemi.com/; ComponentLink2Description: Datasheet; ComponentLink2URL: http://www.fairchildsemi.com/ds/2N%2F2N3904.pdf; Supplier 1: Digi-Key; Supplier 2: Mouser; Supplier Part Number 1: BCX19LT1GOSCT-ND; Supplier Part Number 2: 512-BCX19
R15 = Resistor_Pack_100R: Isolated Resistor Network - Parts; Sim Note: Enter the Resistance value into parameter field.; Published: 24-Mar-1999; LatestRevisionDate: 29-May-2009; LatestRevisionNote: IPC-7351 Footprint Added.; PackageReference: SOIC16; Publisher: Altium Limited; PackageDescription: 16-Pin Small Outline Integrated Circuit 1.27 mm Pitch; Code_JEDEC: MS-012-AC; Code_IPC: SOIC127P600-16; Value: 100R; Supplier 1: Digi-Key; Supplier 2: Mouser; Supplier Part Number 1: 742C083101JPCT-ND; Supplier Part Number 2: 774-742C083101JP
R21 = Resistor_10K: Resistor; Published: 8-Jun-2000; LatestRevisionDate: 29-May-2009; LatestRevisionNote: IPC-7351 Footprint Added.; PackageReference: J1-0603; Publisher: Altium Limited; PackageDescription: Chip Resistor; Value: 10K; Supplier 1: Digi-Key; Supplier 2: Mouser; Supplier Part Number 1: 311-10KGRCT-ND; Supplier Part Number 2: 603-AF0603FR-0710KL
R22 = Resistor_470R: Resistor; Published: 8-Jun-2000; LatestRevisionDate: 29-May-2009; LatestRevisionNote: IPC-7351 Footprint Added.; PackageReference: J1-0603; Publisher: Altium Limited; PackageDescription: Chip Resistor; Value: 470R; Supplier 1: Digi-Key; Supplier 2: Mouser; Supplier Part Number 1: 311-470GRCT-ND; Supplier Part Number 2: 603-AF0603FR-07470RL
R23 = Resistor_4K7: Resistor; Published: 8-Jun-2000; LatestRevisionDate: 29-May-2009; LatestRevisionNote: IPC-7351 Footprint Added.; PackageReference: J1-0603; Publisher: Altium Limited; PackageDescription: Chip Resistor; Value: 4K7; Supplier 1: Digi-Key; Supplier 2: Mouser; Supplier Part Number 1: 311-4.7KGRCT-ND; Supplier Part Number 2: 660-RK73H1JTTD4701F
TP1 TP2 = TestPoint: Header, 2-Pin; LatestRevisionDate: 17-Jul-2002; LatestRevisionNote: Re-released for DXP Platform.; Publisher: Altium Limited
  TP2: Supplier 1: Digi-Key; Supplier 2: Mouser
U5 U6 = CMP-1009-00001-1: 8-Channel EMI Filter with Integrated ESD Protection, -40 to 85 degC, 16-Pin DFN, Pb-Free, Tape and Reel; Manufacturer: ON Semiconductor; VRWM Max (V): 5; Number of Lines: 8; V(BR) Typ (V): 7; PartNumber: NUF8402MNT4G; Mounting Technology: Surface Mount; ComponentLink2Description: Package Specification; ComponentLink1Description: Datasheet; Packing: Tape and Reel; DatasheetVersion: Rev. 7; PackageVersion: Rev. D, 08/2013; RoHS: Pb-Free; ComponentLink2URL: http://www.onsemi.com/pub_link/Collateral/506AC.PDF; PackageReference: DFN-16-506AC; PackageDescription: 16-Pin Small Outline No-Lead, Body 4 x 1.6 mm, Pitch 0.5 mm; ComponentLink1URL: http://www.onsemi.com/pub/Collateral/NUF8402MN-D.PDF
U8 U9 = CMP-1066-00031-1: 2 Line EMI Filter with ESD Protection, -40 to 85 degC, 6-Pin SOT-563, Pb-Free, Tape and Reel; Manufacturer: On Semiconductor; VRWM Max (V): 5; C Typ (pF): 16; V(BR) Typ (V): 7; Number of Lines: 2; Mounting Technology: Surface Mount; ComponentLink3Description: Package Specification; RoHS: Pb-Free; PackageDescription: 6-Pin Small Outline Transistor, Body 1.6 x 1.2 mm, Pitch 0.5 mm; ComponentLink3URL: http://www.onsemi.cn/pub_link/Collateral/463A-01.PDF; ComponentLink2Description: Datasheet; DatasheetVersion: Rev. 3; Packing: Tape and Reel; ComponentLink1Description: Manufacturer URL; PackageVersion: Rev. F, 04/2005; ComponentLink1URL: http://www.onsemi.com/; PackageReference: SOT-563-6-463A-01; PartNumber: NUF2230XV6T1G; ComponentLink2URL: http://www.onsemi.cn/pub_link/Collateral/NUF2230XV6-D.PDF

## Nets that join several sheets
3V3: CPU (VR1.3), Ethernet (FB1.1 FB2.1)
5V: CPU (15 pins), Output (12 pins)
12V: CPU (10 pins), Output (5 pins)
48V: CPU (U3.6 U7.1), Ethernet (D1.+ D2.+ D8.2)
CGND: CPU (R18.1 U3.5 U7.4), Ethernet (D1.- D2.- D8.1)
GND: CPU (31 pins), Ethernet (31 pins), Output (20 pins)
A0/D14: CPU (U1.23), Output (U6.16)
A1/D15: CPU (U1.24), Output (U6.15)
A2/D16: CPU (U1.25), Output (U5.12)
A6: CPU (U1.19), Output (TP1.1)
A7: CPU (U1.22), Output (TP2.1)
D5-PWM: CPU (U1.9), Output (R15.8 U6.9)
D6-PWM: CPU (U1.10), Output (R15.7 U6.10)
D8: CPU (U1.12), Output (R23.2)
D9-PWM: CPU (U1.13), Output (R15.6 U6.11)
D10-PWM: CPU (U1.14), Output (R15.5 U6.12)
D17: CPU (U1.26), Output (U6.14)
E-CS: CPU (U1.2), Ethernet (R19.1 U2.32)
E-INT: CPU (U1.32), Ethernet (R3.8 SEL1.2)
E-RST: CPU (R1.5 U1.11), Ethernet (U2.37)
EXT_INT_SEL: Ethernet (SEL1.1), Output (U8.1)
INT1/D3: CPU (U1.1), Output (R21.2 U8.6)
MISO: CPU (U1.16), Ethernet (U2.34), Output (U5.15)
MOSI: CPU (U1.15), Ethernet (U2.35), Output (U5.16)
RST: CPU (R1.6 S1.3 S1.4 U1.29), Output (C20.2 U5.13)
SCK: CPU (U1.17), Ethernet (U2.33), Output (U5.14)
SCL: CPU (R1.7 U1.28), Output (U5.11)
SDA: CPU (R1.8 U1.27), Output (U5.10)
XD1_N: CPU (U1.30), Output (U9.4)
XD1_P: CPU (U1.31), Output (U9.3)

## Assembly variants
Full Board: all parts fitted
Cheep: not fitted U3